# Altium schematic sheet mezzanine.SchDoc: Mezzanine connector and power
size A3; Date: DO NOT USE, RATHER USE PROJ OPTIONS; DrawnBy: DO NOT USE, RATHER USE PROJ OPTIONS; Engineer: DO NOT USE, RATHER USE PROJ OPTIONS; Organization: DO NOT USE, RATHER USE PROJ OPTIONS; DocumentNumber: DO NOT USE, RATHER USE PROJ OPTIONS; Revision: DO NOT USE, RATHER USE PROJ OPTIONS; SheetNumber: 1; SheetTotal: 4; SCH_Sheet_Filename: mezzanine.SchDoc; CurrentTime: DO NOT USE, RATHER USE PROJ OPTIONS; Time: DO NOT USE, RATHER USE PROJ OPTIONS; DocumentFullPathAndName: DO NOT USE, RATHER USE PROJ OPTIONS; DocumentName: DO NOT USE, RATHER USE PROJ OPTIONS; ModifiedDate: DO NOT USE, RATHER USE PROJ OPTIONS; ImagePath: DO NOT USE, RATHER USE PROJ OPTIONS
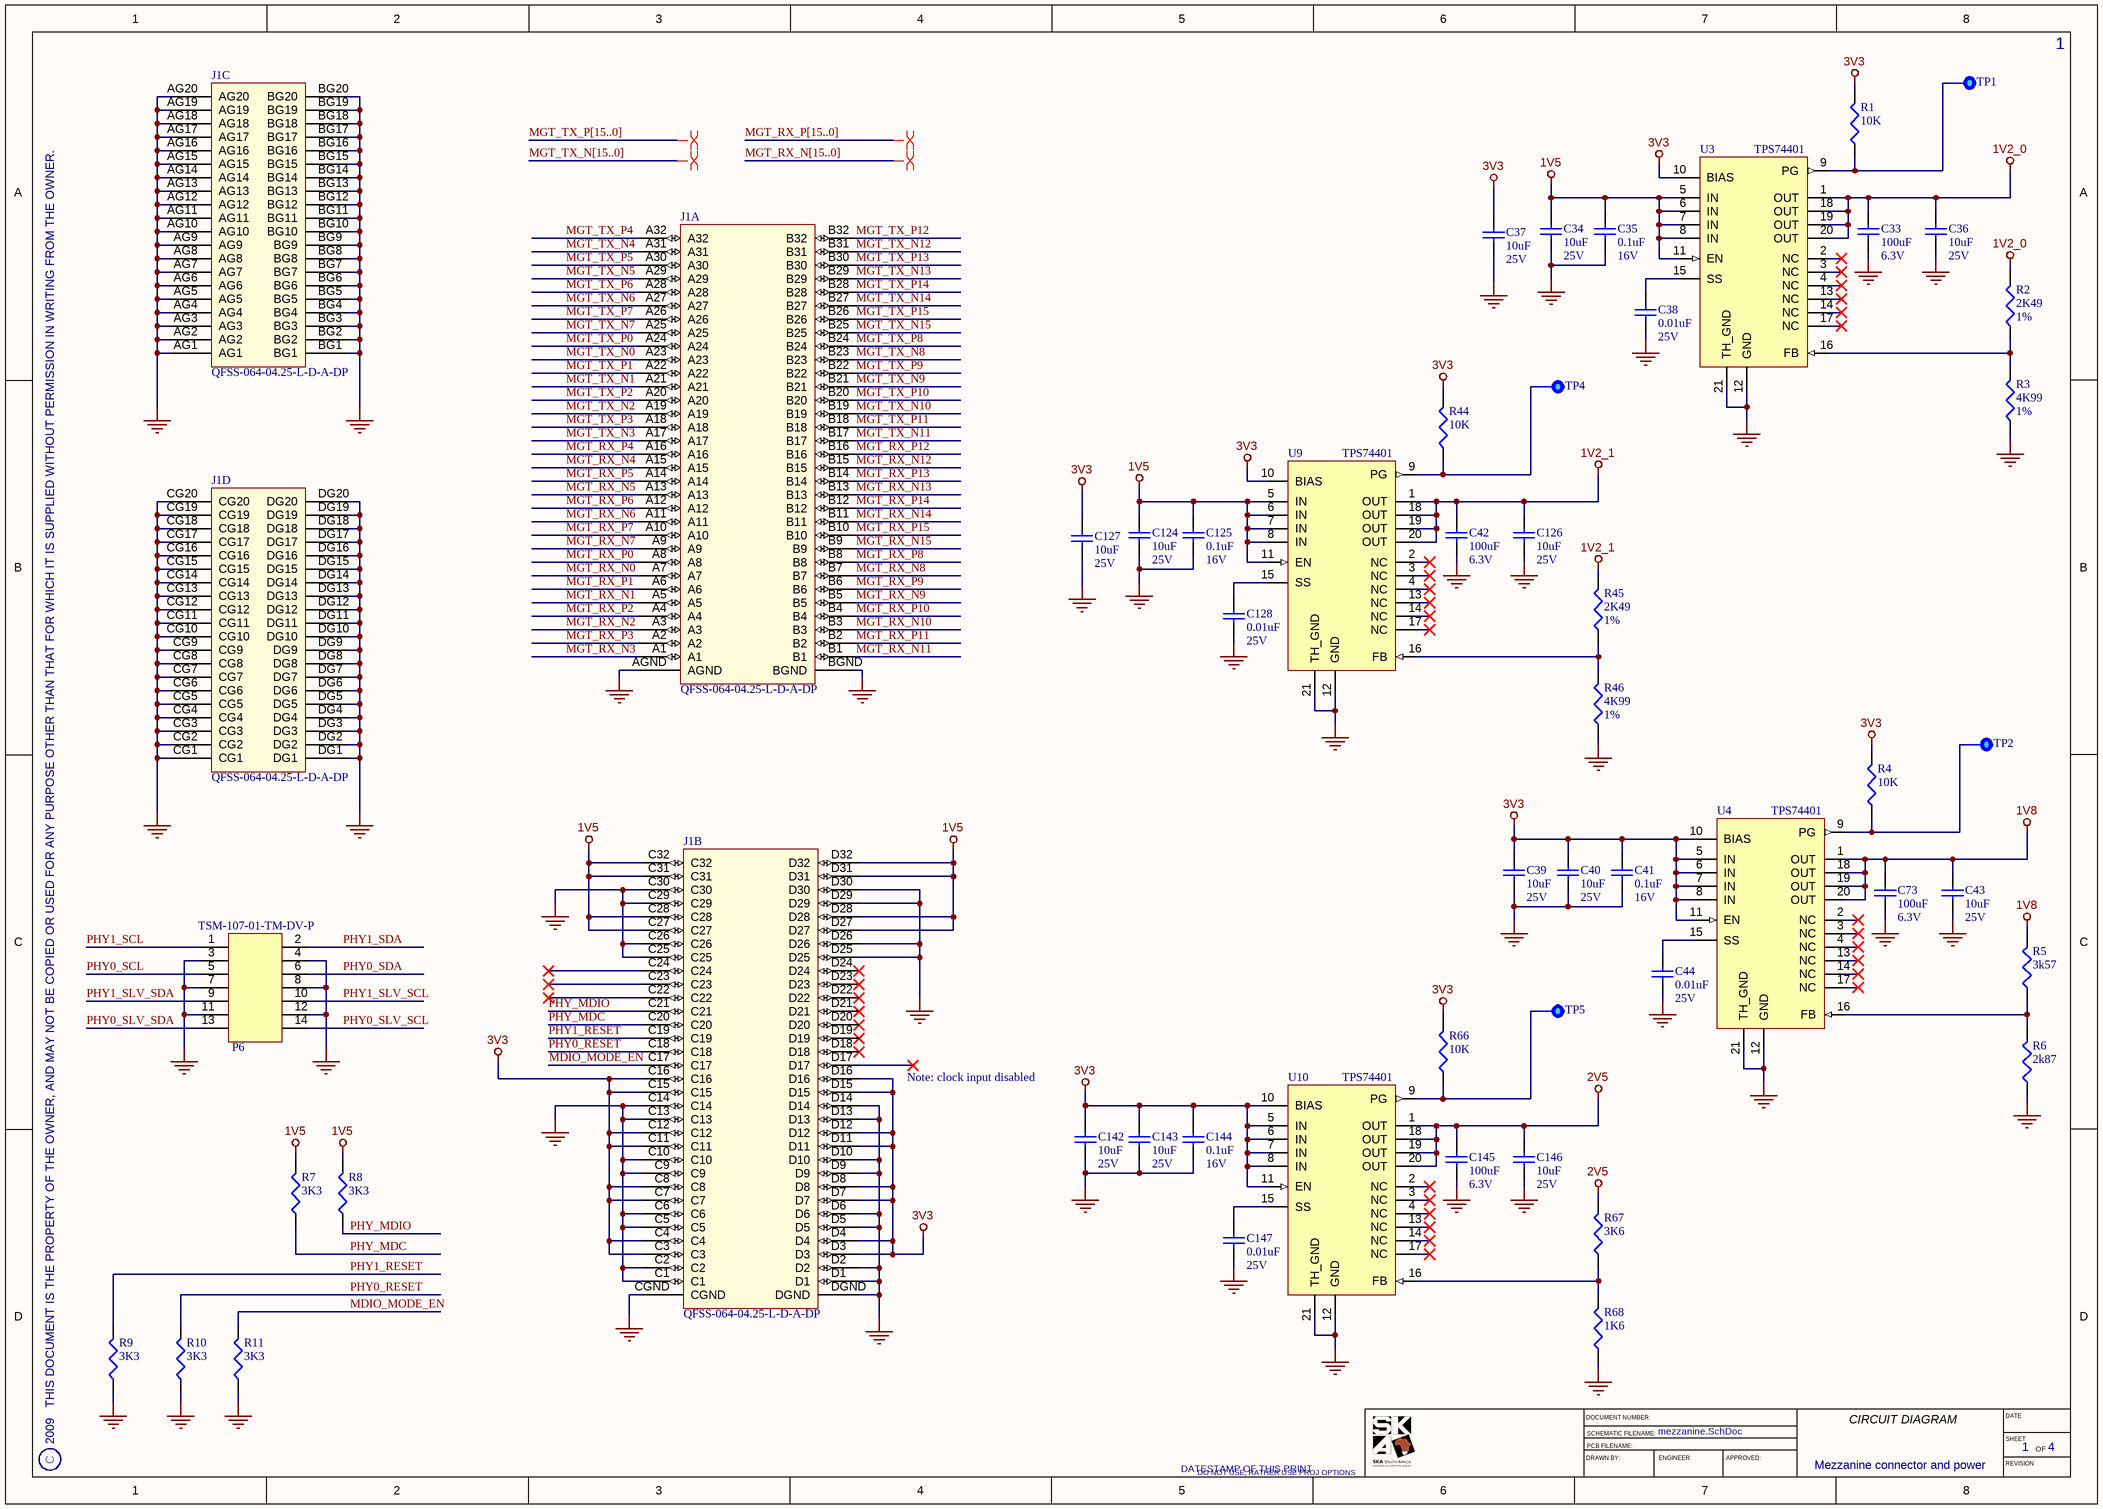
[diagram p0: mezzanine.SchDoc]

## Parts
C33  Rating: 6.3V  [CAPC3225X270L]  (hidden comment: 100uF)
C34  Rating: 25V  [CAPC3225X200L]  (hidden comment: 10uF)
C35  Rating: 16V  [CAPC1005X60L]  (hidden comment: 0.1uF)
C36  Rating: 25V  [CAPC3225X200L]  (hidden comment: 10uF)
C37  Rating: 25V  [CAPC3225X200L]  (hidden comment: 10uF)
C38  Rating: 25V  [CAPC1005X55L]  (hidden comment: 0.01uF)
C39  Rating: 25V  [CAPC3225X200L]  (hidden comment: 10uF)
C40  Rating: 25V  [CAPC3225X200L]  (hidden comment: 10uF)
C41  Rating: 16V  [CAPC1005X60L]  (hidden comment: 0.1uF)
C42  Rating: 6.3V  [CAPC3225X270L]  (hidden comment: 100uF)
C43  Rating: 25V  [CAPC3225X200L]  (hidden comment: 10uF)
C44  Rating: 25V  [CAPC1005X55L]  (hidden comment: 0.01uF)
C73  Rating: 6.3V  [CAPC3225X270L]  (hidden comment: 100uF)
C124  Rating: 25V  [CAPC3225X200L]  (hidden comment: 10uF)
C125  Rating: 16V  [CAPC1005X60L]  (hidden comment: 0.1uF)
C126  Rating: 25V  [CAPC3225X200L]  (hidden comment: 10uF)
C127  Rating: 25V  [CAPC3225X200L]  (hidden comment: 10uF)
C128  Rating: 25V  [CAPC1005X55L]  (hidden comment: 0.01uF)
C142  Rating: 25V  [CAPC3225X200L]  (hidden comment: 10uF)
C143  Rating: 25V  [CAPC3225X200L]  (hidden comment: 10uF)
C144  Rating: 16V  [CAPC1005X60L]  (hidden comment: 0.1uF)
C145  Rating: 6.3V  [CAPC3225X270L]  (hidden comment: 100uF)
C146  Rating: 25V  [CAPC3225X200L]  (hidden comment: 10uF)
C147  Rating: 25V  [CAPC1005X55L]  (hidden comment: 0.01uF)
J1  QFSS-064-04.25-L-D-A-DP  [SAMTEC_QFSS-064-04.25-L-D-DP-A]  (parts A,B,C,D of 4)
P6  TSM-107-01-TM-DV-P  [SAMTEC_TSM-107-01-TM-DV-P]
R1  10K  [RESC1005X40L]
R2  Tolerance: 1%  [RESC1005X40L]  (hidden comment: 2K49)
R3  Tolerance: 1%  [RESC1005X40L]  (hidden comment: 4K99)
R4  10K  [RESC1005X40L]
R5  3k57  [RESC1005X40L]
R6  2k87  [RESC1005X40L]
R7  3K3  [RESC1005X40L]
R8  3K3  [RESC1005X40L]
R9  3K3  [RESC1005X40L]
R10  3K3  [RESC1005X40L]
R11  3K3  [RESC1005X40L]
R44  10K  [RESC1005X40L]
R45  Tolerance: 1%  [RESC1005X40L]  (hidden comment: 2K49)
R46  Tolerance: 1%  [RESC1005X40L]  (hidden comment: 4K99)
R66  10K  [RESC1005X40L]
R67  3K6  [RESC1005X40L]
R68  1K6  [RESC1005X40L]
TP1  Testpoint  [TP100]  (value not drawn)  (no BOM)
TP2  Testpoint  [TP100]  (value not drawn)  (no BOM)
TP4  Testpoint  [TP100]  (value not drawn)  (no BOM)
TP5  Testpoint  [TP100]  (value not drawn)  (no BOM)
U3  TPS74401  [VQFN20]
U4  TPS74401  [VQFN20]
U9  TPS74401  [VQFN20]
U10  TPS74401  [VQFN20]

## Nets
1V2_0: C33.2 C36.2 R2.2 U3.1(OUT) U3.18(OUT) U3.19(OUT) U3.20(OUT)
1V2_1: C42.2 C126.2 R45.2 U9.1(OUT) U9.18(OUT) U9.19(OUT) U9.20(OUT)
1V5: C34.2 C35.2 C124.2 C125.2 J1.C27 J1.C28 J1.C31 J1.C32 J1.D27 J1.D28 J1.D31 J1.D32 R7.2 R8.2 U3.5(IN) U3.6(IN) U3.7(IN) U3.8(IN) U3.11(EN) U9.5(IN) U9.6(IN) U9.7(IN) U9.8(IN) U9.11(EN)
1V8: C43.2 C73.2 R5.2 U4.1(OUT) U4.18(OUT) U4.19(OUT) U4.20(OUT)
2V5: C145.2 C146.2 R67.2 U10.1(OUT) U10.18(OUT) U10.19(OUT) U10.20(OUT)
3V3: C37.2 C39.2 C40.2 C41.2 C127.2 C142.2 C143.2 C144.2 J1.C3 J1.C4 J1.C7 J1.C8 J1.C11 J1.C12 J1.C15 J1.C16 J1.D3 J1.D4 J1.D7 J1.D8 J1.D11 J1.D12 J1.D15 J1.D16 R1.2 R4.2 R44.2 R66.2 U3.10(BIAS) U4.5(IN) U4.6(IN) U4.7(IN) U4.8(IN) U4.10(BIAS) U4.11(EN) U9.10(BIAS) U10.5(IN) U10.6(IN) U10.7(IN) U10.8(IN) U10.10(BIAS) U10.11(EN)
GND: C33.1 C34.1 C35.1 C36.1 C37.1 C38.1 C39.1 C40.1 C41.1 C42.1 C43.1 C44.1 C73.1 C124.1 C125.1 C126.1 C127.1 C128.1 C142.1 C143.1 C144.1 C145.1 C146.1 C147.1 J1.AG1 J1.AG2 J1.AG3 J1.AG4 J1.AG5 J1.AG6 J1.AG7 J1.AG8 J1.AG9 J1.AG10 J1.AG11 J1.AG12 J1.AG13 J1.AG14 J1.AG15 J1.AG16 J1.AG17 J1.AG18 J1.AG19 J1.AG20 J1.AGND J1.BG1 J1.BG2 J1.BG3 J1.BG4 J1.BG5 J1.BG6 J1.BG7 J1.BG8 J1.BG9 J1.BG10 J1.BG11 J1.BG12 J1.BG13 J1.BG14 J1.BG15 J1.BG16 J1.BG17 J1.BG18 J1.BG19 J1.BG20 J1.BGND J1.C1 J1.C2 J1.C5 J1.C6 J1.C9 J1.C10 J1.C13 J1.C14 J1.C25 J1.C26 J1.C29 J1.C30 J1.CG1 J1.CG2 J1.CG3 J1.CG4 J1.CG5 J1.CG6 J1.CG7 J1.CG8 J1.CG9 J1.CG10 J1.CG11 J1.CG12 J1.CG13 J1.CG14 J1.CG15 J1.CG16 J1.CG17 J1.CG18 J1.CG19 J1.CG20 J1.CGND J1.D1 J1.D2 J1.D5 J1.D6 J1.D9 J1.D10 J1.D13 J1.D14 J1.D25 J1.D26 J1.D29 J1.D30 J1.DG1 J1.DG2 J1.DG3 J1.DG4 J1.DG5 J1.DG6 J1.DG7 J1.DG8 J1.DG9 J1.DG10 J1.DG11 J1.DG12 J1.DG13 J1.DG14 J1.DG15 J1.DG16 J1.DG17 J1.DG18 J1.DG19 J1.DG20 J1.DGND P6.3 P6.4 P6.7 P6.8 P6.11 P6.12 R3.1 R6.1 R9.1 R10.1 R11.1 R46.1 R68.1 U3.12(GND) U3.21(TH_GND) U4.12(GND) U4.21(TH_GND) U9.12(GND) U9.21(TH_GND) U10.12(GND) U10.21(TH_GND)
MDIO_MODE_EN: J1.C17 R11.2
MGT_RX_N0: J1.A7
MGT_RX_N1: J1.A5
MGT_RX_N2: J1.A3
MGT_RX_N3: J1.A1
MGT_RX_N4: J1.A15
MGT_RX_N5: J1.A13
MGT_RX_N6: J1.A11
MGT_RX_N7: J1.A9
MGT_RX_N8: J1.B7
MGT_RX_N9: J1.B5
MGT_RX_N10: J1.B3
MGT_RX_N11: J1.B1
MGT_RX_N12: J1.B15
MGT_RX_N13: J1.B13
MGT_RX_N14: J1.B11
MGT_RX_N15: J1.B9
MGT_RX_P0: J1.A8
MGT_RX_P1: J1.A6
MGT_RX_P2: J1.A4
MGT_RX_P3: J1.A2
MGT_RX_P4: J1.A16
MGT_RX_P5: J1.A14
MGT_RX_P6: J1.A12
MGT_RX_P7: J1.A10
MGT_RX_P8: J1.B8
MGT_RX_P9: J1.B6
MGT_RX_P10: J1.B4
MGT_RX_P11: J1.B2
MGT_RX_P12: J1.B16
MGT_RX_P13: J1.B14
MGT_RX_P14: J1.B12
MGT_RX_P15: J1.B10
MGT_TX_N0: J1.A23
MGT_TX_N1: J1.A21
MGT_TX_N2: J1.A19
MGT_TX_N3: J1.A17
MGT_TX_N4: J1.A31
MGT_TX_N5: J1.A29
MGT_TX_N6: J1.A27
MGT_TX_N7: J1.A25
MGT_TX_N8: J1.B23
MGT_TX_N9: J1.B21
MGT_TX_N10: J1.B19
MGT_TX_N11: J1.B17
MGT_TX_N12: J1.B31
MGT_TX_N13: J1.B29
MGT_TX_N14: J1.B27
MGT_TX_N15: J1.B25
MGT_TX_P0: J1.A24
MGT_TX_P1: J1.A22
MGT_TX_P2: J1.A20
MGT_TX_P3: J1.A18
MGT_TX_P4: J1.A32
MGT_TX_P5: J1.A30
MGT_TX_P6: J1.A28
MGT_TX_P7: J1.A26
MGT_TX_P8: J1.B24
MGT_TX_P9: J1.B22
MGT_TX_P10: J1.B20
MGT_TX_P11: J1.B18
MGT_TX_P12: J1.B32
MGT_TX_P13: J1.B30
MGT_TX_P14: J1.B28
MGT_TX_P15: J1.B26
PHY0_RESET: J1.C18 R10.2
PHY0_SCL: P6.5
PHY0_SDA: P6.6
PHY0_SLV_SCL: P6.14
PHY0_SLV_SDA: P6.13
PHY1_RESET: J1.C19 R9.2
PHY1_SCL: P6.1
PHY1_SDA: P6.2
PHY1_SLV_SCL: P6.10
PHY1_SLV_SDA: P6.9
PHY_MDC: J1.C20 R7.1
PHY_MDIO: J1.C21 R8.1
NetC38_2: C38.2 U3.15(SS)
NetC44_2: C44.2 U4.15(SS)
NetC128_2: C128.2 U9.15(SS)
NetC147_2: C147.2 U10.15(SS)
NetR1_1: R1.1 TP1.1 U3.9(PG)
NetR2_1: R2.1 R3.2 U3.16(FB)
NetR4_1: R4.1 TP2.1 U4.9(PG)
NetR5_1: R5.1 R6.2 U4.16(FB)
NetR44_1: R44.1 TP4.1 U9.9(PG)
NetR45_1: R45.1 R46.2 U9.16(FB)
NetR66_1: R66.1 TP5.1 U10.9(PG)
NetR67_1: R67.1 R68.2 U10.16(FB)

Not connected (* = marked no-connect by the designer): J1 C22* C23* C24* D17* D18* D19* D20* D21* D22* D23* D24*; U3 2(NC)* 3(NC)* 4(NC)* 13(NC)* 14(NC)* 17(NC)*; U4 2(NC)* 3(NC)* 4(NC)* 13(NC)* 14(NC)* 17(NC)*; U9 2(NC)* 3(NC)* 4(NC)* 13(NC)* 14(NC)* 17(NC)*; U10 2(NC)* 3(NC)* 4(NC)* 13(NC)* 14(NC)* 17(NC)*

## Buses and harness runs
bus MGT_RX_N[15..0]
bus MGT_RX_P[15..0]
bus MGT_TX_N[15..0]
bus MGT_TX_P[15..0]

## Layout directives
differential pair: (no net found under the mark)

## Notes on the sheet
- (near C142) Note: clock input disabled
- 2009   THIS DOCUMENT IS THE PROPERTY OF THE OWNER, AND MAY NOT BE COPIED OR USED FOR ANY PURPOSE OTHER THAN THAT FOR WHICH IT IS SUPPLIED WITHOUT PERMISSION IN WRITING FROM THE OWNER.
- C
- DATESTAMP OF THIS PRINT
- DRAWN BY:
- DOCUMENT NUMBER:
- SCHEMATIC FILENAME:
- PCB FILENAME:
- ENGINEER:
- APPROVED:
- CIRCUIT DIAGRAM
- DATE
- SHEET
- REVISION
- OF

## Library data of the parts
C33 C42 C73 C145 = CAP-CER-13: 100uF, 1210, Ceramic Capacitor; Manufacturer: TDK; PartNum: C3225X5R0J107M; Tolerance: 20%; Dielectric: X5R; POD number: CAP-CER-13; Value: 100uF; RoHS: Y; Sort Value: 100; Category: Capacitors; Subcategory: Ceramic
C34 C36 C37 C39 C40 C43 C124 C126 C127 C142 C143 C146 = CAP-CER-5: 10uF, Ceramic Capacitor; Manufacturer: MURATA; PartNum: GRM32DR61E106KA12L; Tolerance: 10%; Dielectric: X5R; POD number: CAP-CER-5; Value: 10uF; RoHS: Y; Sort Value: 100; Category: Capacitors; Subcategory: Ceramic
C35 C41 C125 C144 = CAP-CER-1: 0.1uF, Ceramic Capacitor; Manufacturer: VENKEL; PartNum: C0402X7R160-104KN; Tolerance: 10%; Dielectric: X7R; POD number: CAP-CER-1; Value: 0.1uF; RoHS: Y; Sort Value: 0.1; Category: Capacitors; Subcategory: Ceramic
C38 C44 C128 C147 = CAP-CER-6: 0.01uF, Ceramic Capacitor; Manufacturer: MURATA; PartNum: GRM155R71E103KA01D; Tolerance: 10%; Dielectric: X7R; POD number: CAP-CER-6; Value: 0.01uF; RoHS: Y; Sort Value: 0.01; Category: Capacitors; Subcategory: Ceramic
J1 = CONN-PCB-19: Shielded, 64-Differential Pair, Rugged High-Speed Terminal Strip, 0.635mm Pitch; Manufacturer: SAMTEC; POD number: CONN-PCB-19; PartNum: QFSS-064-04.25-L-D-A-DP; RoHS: Y; Category: CONN; Subcategory: PCB
P6 = CONN-PCB-16: 2x7, 2.54 mm Pitch, Male Header; Manufacturer: SAMTEC; POD number: CONN-PCB-16; PartNum: TSM-107-01-TM-DV-P; RoHS: Y; Category: CONN; Subcategory: PCB
R1 R4 R44 R66 = RES-TF-5: 10K, 1.1mm x 0.5mm, Thick Film Resistor; Manufacturer: ROYALOHM; PartNum: 0402WGJ0103T1E; Tolerance: 5%; Rating: 0.0625W; POD number: RES-TF-5; Value: 10K; Sort Value: 10000; Category: Resistors; Subcategory: ThickFilm; HelpURL: *.pdf
R2 R45 = RES-TF-36: 2K49, 1.1mm x 0.5mm, Thick Film Resistor; Manufacturer: ROYALOHM; PartNum: 0402WGF2K49T1E; Rating: 0.0625W; POD number: RES-TF-36; Value: 2K49; Sort Value: 2490; Category: Resistors; Subcategory: ThickFilm; HelpURL: *.pdf
R3 R46 = RES-TF-13: 4K99, 1.1mm x 0.5mm, Thick Film Resistor; Manufacturer: ROYALOHM; PartNum: 0402WGF4991T1E; Rating: 0.0625W; POD number: RES-TF-13; Value: 4K99; Sort Value: 4990; Category: Resistors; Subcategory: ThickFilm; HelpURL: *.pdf
R5 = RES-TF-45: 3K57, 1.1mm x 0.5mm, Thick Film Resistor; Manufacturer: STACKPOLE; PartNum: RMC0402FT3K57; Tolerance: 1%; Rating: 0.0625W; POD number: RES-TF-45; Value: 3k57; RoHS: Y; Sort Value: 3570; Category: Resistors; Subcategory: ThickFilm; HelpURL: http://www.royalohm.com/pdf/general.pdf
R6 = RES-TF-46: 2K87, 1.1mm x 0.5mm, Thick Film Resistor; Manufacturer: STACKPOLE; PartNum: RMC0402FT2K87; Tolerance: 1%; Rating: 0.0625W; POD number: RES-TF-46; Value: 2k87; RoHS: Y; Sort Value: 2870; Category: Resistors; Subcategory: ThickFilm; HelpURL: http://www.royalohm.com/pdf/general.pdf
R7-R11 = RES-TF-7: 3K3, 1.1mm x 0.5mm, Thick Film Resistor; Manufacturer: ROYALOHM; PartNum: 0402WGJ0332T1E; Tolerance: 5%; Rating: 0.0625W; POD number: RES-TF-7; Value: 3K3; Sort Value: 3300; Category: Resistors; Subcategory: ThickFilm; HelpURL: http://www.royalohm.com/pdf/general.pdf
R67 = RES-TF-55: 3K6, 1.1mm x 0.5mm, Thick Film Resistor; Manufacturer: ROYALOHM; PartNum: 0402WGF3601T1E; Tolerance: 1%; Rating: 0.0625W; POD number: RES-TF-55; RoHS: Y; Value: 3K6; Sort Value: 3600; Category: Resistors; Subcategory: ThickFilm; HelpURL: http://www.royalohm.com/pdf/general.pdf
R68 = RES-TF-54: 1K6, 1.1mm x 0.5mm, Thick Film Resistor; Manufacturer: ROYALOHM; PartNum: 0402WGF1601T1E; Tolerance: 1%; Rating: 0.0625W; POD number: RES-TF-54; RoHS: Y; Value: 1K6; Sort Value: 1600; Category: Resistors; Subcategory: ThickFilm; HelpURL: http://www.royalohm.com/pdf/general.pdf
TP1 TP2 TP4 TP5 = ELMECH-TP-0: 1mm Diameter, through-hole, Circular Test-point; POD number: ELMECH-TP-0; RoHS: Y; Category: ELMECH; Subcategory: Test Points
U3 U4 U9 U10 = IC-REG-5: 3.0A Ultra-LDO with Programmable Soft-Start; Manufacturer: Texas Instruments; POD number: IC-REG-5; PartNum: TPS74401; RoHS: Y; Category: IC; Subcategory: Regulators